# Altium project DASH_V_3.PrjPCB
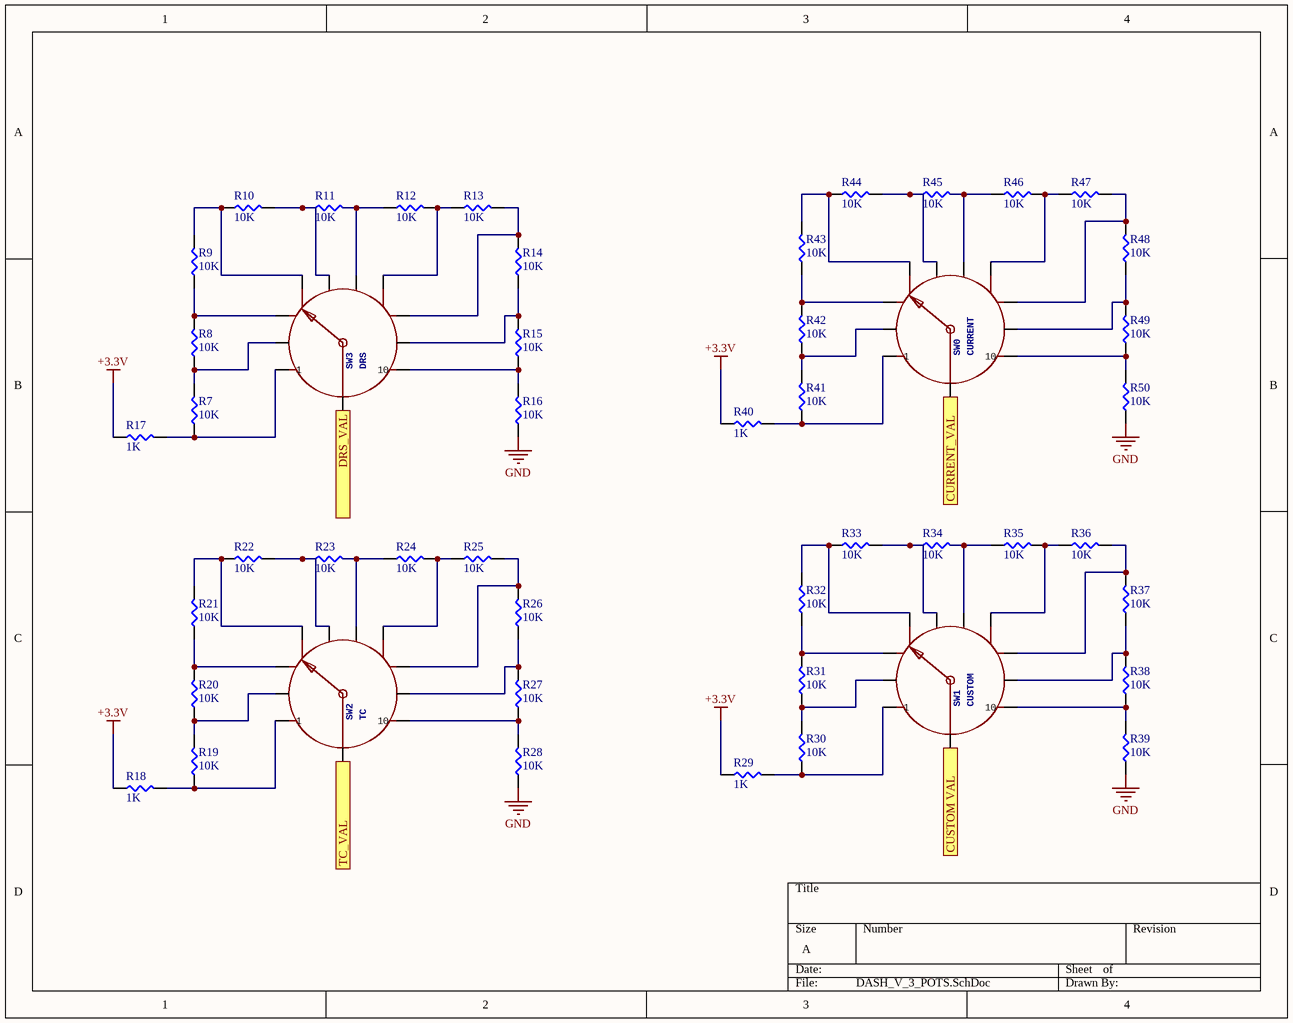
[diagram p0: DASH_V_3_POTS.SchDoc]
3 sheets, 94 parts. Net scope: flat (ports and power ports of the same name join across sheets).
Board file: DASH_V_3.PcbDoc
Sheets:
  DASH_V_3_POTS.SchDoc
  DASH_V_3_LEDS_POWER.SchDoc
  DASH_V_3_STM_CAN.SchDoc

## Sheet DASH_V_3_POTS.SchDoc
size A

### Parts
R7  10K  [RES-0603]
R8  10K  [RES-0603]
R9  10K  [RES-0603]
R10  10K  [RES-0603]
R11  10K  [RES-0603]
R12  10K  [RES-0603]
R13  10K  [RES-0603]
R14  10K  [RES-0603]
R15  10K  [RES-0603]
R16  10K  [RES-0603]
R17  1K  [RES-0603]
R18  1K  [RES-0603]
R19  10K  [RES-0603]
R20  10K  [RES-0603]
R21  10K  [RES-0603]
R22  10K  [RES-0603]
R23  10K  [RES-0603]
R24  10K  [RES-0603]
R25  10K  [RES-0603]
R26  10K  [RES-0603]
R27  10K  [RES-0603]
R28  10K  [RES-0603]
R29  1K  [RES-0603]
R30  10K  [RES-0603]
R31  10K  [RES-0603]
R32  10K  [RES-0603]
R33  10K  [RES-0603]
R34  10K  [RES-0603]
R35  10K  [RES-0603]
R36  10K  [RES-0603]
R37  10K  [RES-0603]
R38  10K  [RES-0603]
R39  10K  [RES-0603]
R40  1K  [RES-0603]
R41  10K  [RES-0603]
R42  10K  [RES-0603]
R43  10K  [RES-0603]
R44  10K  [RES-0603]
R45  10K  [RES-0603]
R46  10K  [RES-0603]
R47  10K  [RES-0603]
R48  10K  [RES-0603]
R49  10K  [RES-0603]
R50  10K  [RES-0603]
SW0  CURRENT  [SPARKFUN-ELECTROMECHANICAL_ROTARY_SWITCH_1X10_KIT]
SW1  CUSTOM  [SPARKFUN-ELECTROMECHANICAL_ROTARY_SWITCH_1X10_KIT]
SW2  TC  [SPARKFUN-ELECTROMECHANICAL_ROTARY_SWITCH_1X10_KIT]
SW3  DRS  [SPARKFUN-ELECTROMECHANICAL_ROTARY_SWITCH_1X10_KIT]

### Ports
CURRENT_VAL, CUSTOM VAL, DRS_VAL, TC_VAL

### Nets
+3.3V: R17.1 R18.1 R29.1 R40.1
GND: R16.1 R28.1 R39.1 R50.1
CURRENT_VAL: SW0.COMMON ; port CURRENT_VAL
CUSTOM VAL: SW1.COMMON ; port CUSTOM VAL
DRS_VAL: SW3.COMMON ; port DRS_VAL
TC_VAL: SW2.COMMON ; port TC_VAL
NetR7_1: R7.1 R17.2 SW3.1
NetR7_2: R7.2 R8.1 SW3.2
NetR8_2: R8.2 R9.1 SW3.3
NetR9_2: R9.2 R10.1 SW3.4
NetR10_2: R10.2 R11.1 SW3.5
NetR11_2: R11.2 R12.1 SW3.6
NetR12_2: R12.2 R13.1 SW3.7
NetR13_2: R13.2 R14.2 SW3.8
NetR14_1: R14.1 R15.2 SW3.9
NetR15_1: R15.1 R16.2 SW3.10
NetR18_2: R18.2 R19.1 SW2.1
NetR19_2: R19.2 R20.1 SW2.2
NetR20_2: R20.2 R21.1 SW2.3
NetR21_2: R21.2 R22.1 SW2.4
NetR22_2: R22.2 R23.1 SW2.5
NetR23_2: R23.2 R24.1 SW2.6
NetR24_2: R24.2 R25.1 SW2.7
NetR25_2: R25.2 R26.2 SW2.8
NetR26_1: R26.1 R27.2 SW2.9
NetR27_1: R27.1 R28.2 SW2.10
NetR29_2: R29.2 R30.1 SW1.1
NetR30_2: R30.2 R31.1 SW1.2
NetR31_2: R31.2 R32.1 SW1.3
NetR32_2: R32.2 R33.1 SW1.4
NetR33_2: R33.2 R34.1 SW1.5
NetR34_2: R34.2 R35.1 SW1.6
NetR35_2: R35.2 R36.1 SW1.7
NetR36_2: R36.2 R37.2 SW1.8
NetR37_1: R37.1 R38.2 SW1.9
NetR38_1: R38.1 R39.2 SW1.10
NetR40_2: R40.2 R41.1 SW0.1
NetR41_2: R41.2 R42.1 SW0.2
NetR42_2: R42.2 R43.1 SW0.3
NetR43_2: R43.2 R44.1 SW0.4
NetR44_2: R44.2 R45.1 SW0.5
NetR45_2: R45.2 R46.1 SW0.6
NetR46_2: R46.2 R47.1 SW0.7
NetR47_2: R47.2 R48.2 SW0.8
NetR48_1: R48.1 R49.2 SW0.9
NetR49_1: R49.1 R50.2 SW0.10

### Library data of the parts
R7-R50 = RES-0603
SW0-SW3 = SPARKFUN-ELECTROMECHANICAL_SWITCH_ROTARY_1X10KIT: GateName_1: G$1; SymbolName_1: SPARKFUN-ELECTROMECHANICAL_ROTARY-SWITCH-1X10; DeviceName: KIT; PROD_ID: SWCH-12120; LibraryName: Rotary_Switch_Potentiometer_v10; DeviceSetName: SPARKFUN-ELECTROMECHANICAL_SWITCH_ROTARY_1X10; Package: SPARKFUN-ELECTROMECHANICAL_ROTARY_SWITCH_1X10_KIT

## Sheet DASH_V_3_LEDS_POWER.SchDoc
size A
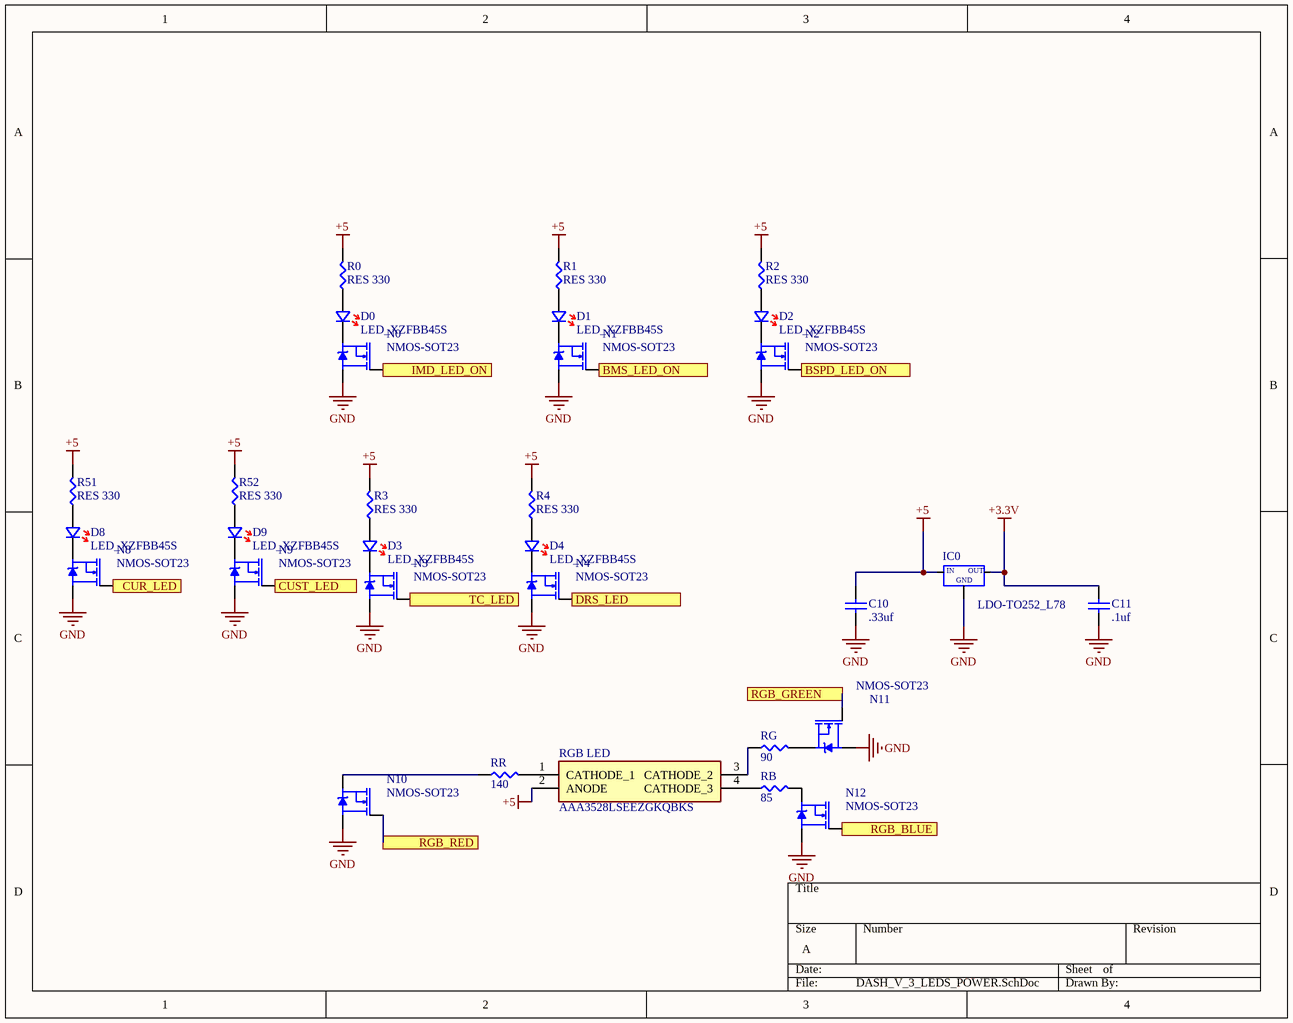
[diagram p1: DASH_V_3_LEDS_POWER.SchDoc]

### Parts
C10  .33uf  [CAPC1608X87X35NL15T15]
C11  .1uf  [CAPC1608X87X35NL15T15]
D0  LED_XZFBB45S  [LED_XZFBB45S]
D1  LED_XZFBB45S  [LED_XZFBB45S]
D2  LED_XZFBB45S  [LED_XZFBB45S]
D3  LED_XZFBB45S  [LED_XZFBB45S]
D4  LED_XZFBB45S  [LED_XZFBB45S]
D8  LED_XZFBB45S  [LED_XZFBB45S]
D9  LED_XZFBB45S  [LED_XZFBB45S]
IC0  LDO-TO252_L78  [TO252]
N0  NMOS-SOT23  [SOT23]
N1  NMOS-SOT23  [SOT23]
N2  NMOS-SOT23  [SOT23]
N3  NMOS-SOT23  [SOT23]
N4  NMOS-SOT23  [SOT23]
N8  NMOS-SOT23  [SOT23]
N9  NMOS-SOT23  [SOT23]
N10  NMOS-SOT23  [SOT23]
N11  NMOS-SOT23  [SOT23]
N12  NMOS-SOT23  [SOT23]
R0  RES 330  [RES-0603]
R1  RES 330  [RES-0603]
R2  RES 330  [RES-0603]
R3  RES 330  [RES-0603]
R4  RES 330  [RES-0603]
R51  RES 330  [RES-0603]
R52  RES 330  [RES-0603]
RB  85  [RES-0603]
RG  90  [RES-0603]
RGB_LED  AAA3528LSEEZGKQBKS  [AAA3528]
RR  140  [RES-0603]

### Ports
BMS_LED_ON, BSPD_LED_ON, CUR_LED, CUST_LED, DRS_LED, IMD_LED_ON, RGB_BLUE, RGB_GREEN, RGB_RED, TC_LED

### Nets
+3.3V: C11.2 IC0.3
+5: C10.2 IC0.1 R0.2 R1.2 R2.2 R3.2 R4.2 R51.2 R52.2 RGB_LED.2(ANODE)
GND: C10.1 C11.1 IC0.2 N0.2(S) N1.2(S) N2.2(S) N3.2(S) N4.2(S) N8.2(S) N9.2(S) N10.2(S) N11.2(S) N12.2(S)
BMS_LED_ON: N1.1(G) ; port BMS_LED_ON
BSPD_LED_ON: N2.1(G) ; port BSPD_LED_ON
CUR_LED: N8.1(G) ; port CUR_LED
CUST_LED: N9.1(G) ; port CUST_LED
DRS_LED: N4.1(G) ; port DRS_LED
IMD_LED_ON: N0.1(G) ; port IMD_LED_ON
RGB_BLUE: N12.1(G) ; port RGB_BLUE
RGB_GREEN: N11.1(G) ; port RGB_GREEN
RGB_RED: N10.1(G) ; port RGB_RED
TC_LED: N3.1(G) ; port TC_LED
NetD0_A: D0.A R0.1
NetD0_K: D0.K N0.3(D)
NetD1_A: D1.A R1.1
NetD1_K: D1.K N1.3(D)
NetD2_A: D2.A R2.1
NetD2_K: D2.K N2.3(D)
NetD3_A: D3.A R3.1
NetD3_K: D3.K N3.3(D)
NetD4_A: D4.A R4.1
NetD4_K: D4.K N4.3(D)
NetD8_A: D8.A R51.1
NetD8_K: D8.K N8.3(D)
NetD9_A: D9.A R52.1
NetD9_K: D9.K N9.3(D)
NetN10_3: N10.3(D) RR.1
NetN11_3: N11.3(D) RG.2
NetN12_3: N12.3(D) RB.2
NetRB_1: RB.1 RGB_LED.4(CATHODE_3)
NetRG_1: RG.1 RGB_LED.3(CATHODE_2)
NetRGB_LED_1: RGB_LED.1(CATHODE_1) RR.2

### Notes on the sheet
- (in symbol LDO-TO252_L78) IN; OUT; GND

### Library data of the parts
C10 C11 = CMP-2006-03887-1: .1 uf; Part Number: C0603C104J3RAC7867; Manufacturer: Kemet
R0-R4 R51 R52 RB RG RR = RES-0603
RGB_LED = AAA3528LSEEZGKQBKS: LED; Manufacturer_Name: Kingbright; Datasheet Link: https://componentsearchengine.com/Datasheets/1/AAA3528LSEEZGKQBKS.pdf; Mouser Part Number: 604-AAA3528LSEEZGKQB; Mouser Price/Stock: https://www.mouser.com/Search/Refine.aspx?Keyword=604-AAA3528LSEEZGKQB; Manufacturer_Part_Number: AAA3528LSEEZGKQBKS

## Sheet DASH_V_3_STM_CAN.SchDoc
size A
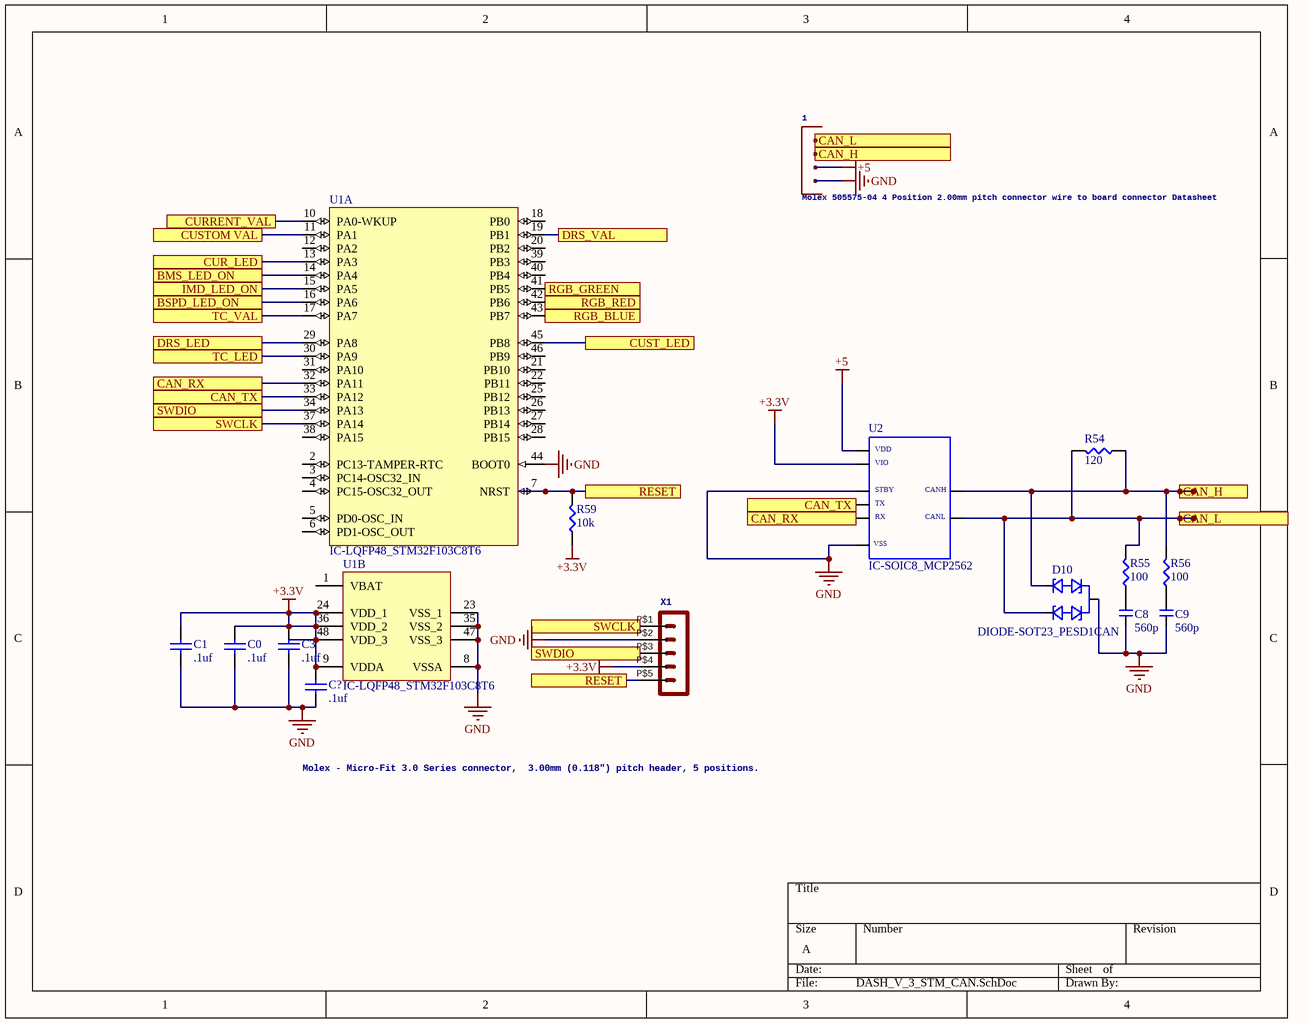
[diagram p2: DASH_V_3_STM_CAN.SchDoc]

### Parts
1  Molex 505575-04 4 Position 2.00mm pitch connector wire to board connector Datasheet  [505575-04]
C0  .1uf  [CAPC1608X87X35NL15T15]
C1  .1uf  [CAPC1608X87X35NL15T15]
C3  .1uf  [CAPC1608X87X35NL15T15]
C8  560p  [CAP-0603]
C9  560p  [CAP-0603]
C?  .1uf  [CAPC1608X87X35NL15T15]
D10  DIODE-SOT23_PESD1CAN  [SOT23]
R54  120  [RES-0603]
R55  100  [RES-0603]
R56  100  [RES-0603]
R59  10k  [RES-0603]
U1  IC-LQFP48_STM32F103C8T6  [STM-LQFP48_M]  (parts A,B of 2)
U2  IC-SOIC8_MCP2562  [SOIC8]
X1  Molex - Micro-Fit 3.0 Series connector,  3.00mm (0.118") pitch header, 5 positions.  [POS5_254MM_MALE]

### Ports
BMS_LED_ON, BSPD_LED_ON, CAN_H, CAN_L, CAN_RX, CAN_TX, CUR_LED, CURRENT_VAL, CUST_LED, CUSTOM VAL, DRS_LED, DRS_VAL, IMD_LED_ON, RESET, RGB_BLUE, RGB_GREEN, RGB_RED, SWCLK, SWDIO, TC_LED, TC_VAL

### Nets
+3.3V: C0.2 C1.2 C3.2 C?.2 R59.1 U1.9(VDDA) U1.24(VDD_1) U1.36(VDD_2) U1.48(VDD_3) U2.5 X1.P$4
+5: 1.3 U2.3
GND: 1.4 C0.1 C1.1 C3.1 C8.1 C9.1 C?.1 D10.3(G) U1.8(VSSA) U1.23(VSS_1) U1.35(VSS_2) U1.44(BOOT0) U1.47(VSS_3) U2.2 U2.8 X1.P$2
BMS_LED_ON: U1.14(PA4) ; port BMS_LED_ON
BSPD_LED_ON: U1.16(PA6) ; port BSPD_LED_ON
CAN_H: 1.2 D10.1(CAN1) R54.1 R56.2 U2.7 ; port CAN_H
CAN_L: 1.1 D10.2(CAN2) R54.2 R55.2 U2.6 ; port CAN_L
CAN_RX: U1.32(PA11) U2.4 ; port CAN_RX
CAN_TX: U1.33(PA12) U2.1 ; port CAN_TX
CUR_LED: U1.13(PA3) ; port CUR_LED
CURRENT_VAL: U1.10(PA0-WKUP) ; port CURRENT_VAL
CUST_LED: U1.45(PB8) ; port CUST_LED
CUSTOM VAL: U1.11(PA1) ; port CUSTOM VAL
DRS_LED: U1.29(PA8) ; port DRS_LED
DRS_VAL: U1.19(PB1) ; port DRS_VAL
IMD_LED_ON: U1.15(PA5) ; port IMD_LED_ON
RESET: R59.2 U1.7(NRST) X1.P$5 ; port RESET
RGB_BLUE: U1.43(PB7) ; port RGB_BLUE
RGB_GREEN: U1.41(PB5) ; port RGB_GREEN
RGB_RED: U1.42(PB6) ; port RGB_RED
SWCLK: U1.37(PA14) X1.P$1 ; port SWCLK
SWDIO: U1.34(PA13) X1.P$3 ; port SWDIO
TC_LED: U1.30(PA9) ; port TC_LED
TC_VAL: U1.17(PA7) ; port TC_VAL
NetC8_2: C8.2 R55.1
NetC9_2: C9.2 R56.1

Not connected (* = marked no-connect by the designer): U1 1(VBAT) 2(PC13-TAMPER-RTC) 3(PC14-OSC32_IN) 4(PC15-OSC32_OUT) 5(PD0-OSC_IN) 6(PD1-OSC_OUT) 12(PA2) 18(PB0) 20(PB2) 21(PB10) 22(PB11) 25(PB12) 26(PB13) 27(PB14) 28(PB15) 31(PA10) 38(PA15) 39(PB3) 40(PB4) 46(PB9)

### Notes on the sheet
- (in symbol IC-SOIC8_MCP2562) VDD; VIO; STBY; CANH; TX; RX; CANL; VSS

### Library data of the parts
1 = 505575-04: GateName_1: G$1; SymbolName_1: 4POS; LibraryName: MOLEX Micro-Lock; DeviceSetName: 505575-04; Package: 505575-04
C0 C1 C3 C? = CMP-2006-03887-1: as C10 on sheet DASH_V_3_LEDS_POWER
C8 C9 = CAP-0603
R54-R56 R59 = RES-0603
U1 = IC-LQFP48_STM32F103C8T6: A/D Converter: 2x12-bit (10 Channel); Core: ARM Cortex-M3; FLASH Size (Prog) (kB): 64; I/Os (High Current): 37; Internal RAM Size (kB): 20; Operating Frequency(F) (Processor speed) (MHz): 72; Packing: Tray; Supply Voltage(Vcc) min (V): 2; DatasheetVersion: Rev. 16; PackageVersion: Rev. 6, 06/2013; PackageReference: LQFP48; PackageDescription: 48-Pin Low Profile Quad Flat Package, 7 x 7 mm Body, 0.5 mm Pitch; Supplier 1: Digi-Key; Supplier Part Number 1: 497-6063-ND; Supplier 2: Farnell; Supplier Part Number 2: 1447637; Supplier 3: Newark; Supplier Part Number 3: 59M2182; Supplier 4: Newark; Supplier Part Number 4: 57P1222; Supplier 5: Mouser; Supplier Part Number 5: 511-STM32F103C8T6; Mounting Technology: Surface Mount; PartNumber: STM32F103C8T6; ComponentLink1Description: Manufacturer URL; ComponentLink1URL: http://www.st.com/web/en/home.html; ComponentLink2Description: Datasheet; ComponentLink2URL: http://www.st.com/st-web-ui/static/active/en/resource/technical/document/datasheet/CD00161566.pdf; ComponentLink3Description: Package Specification; ComponentLink3URL: http://www.st.com/st-web-ui/static/active/en/resource/technical/document/datasheet/DM00058181.pdf
X1 = POS5_254MM_MALE: GateName_1: G$1; SymbolName_1: HEADER_POS5; DeviceName: 43650-0524; DeviceSetName: HEADER_POS5_?; LibraryName: MOLEX Micro-Fit; Package: 43650-0524

## Nets that join several sheets
+3.3V: DASH_V_3_POTS (R17.1 R18.1 R29.1 R40.1), DASH_V_3_LEDS_POWER (C11.2 IC0.3), DASH_V_3_STM_CAN (11 pins)
+5: DASH_V_3_LEDS_POWER (10 pins), DASH_V_3_STM_CAN (1.3 U2.3)
GND: DASH_V_3_POTS (R16.1 R28.1 R39.1 R50.1), DASH_V_3_LEDS_POWER (13 pins), DASH_V_3_STM_CAN (16 pins)
BMS_LED_ON: DASH_V_3_LEDS_POWER (N1.1), DASH_V_3_STM_CAN (U1.14)
BSPD_LED_ON: DASH_V_3_LEDS_POWER (N2.1), DASH_V_3_STM_CAN (U1.16)
CUR_LED: DASH_V_3_LEDS_POWER (N8.1), DASH_V_3_STM_CAN (U1.13)
CURRENT_VAL: DASH_V_3_POTS (SW0.COMMON), DASH_V_3_STM_CAN (U1.10)
CUST_LED: DASH_V_3_LEDS_POWER (N9.1), DASH_V_3_STM_CAN (U1.45)
CUSTOM VAL: DASH_V_3_POTS (SW1.COMMON), DASH_V_3_STM_CAN (U1.11)
DRS_LED: DASH_V_3_LEDS_POWER (N4.1), DASH_V_3_STM_CAN (U1.29)
DRS_VAL: DASH_V_3_POTS (SW3.COMMON), DASH_V_3_STM_CAN (U1.19)
IMD_LED_ON: DASH_V_3_LEDS_POWER (N0.1), DASH_V_3_STM_CAN (U1.15)
RGB_BLUE: DASH_V_3_LEDS_POWER (N12.1), DASH_V_3_STM_CAN (U1.43)
RGB_GREEN: DASH_V_3_LEDS_POWER (N11.1), DASH_V_3_STM_CAN (U1.41)
RGB_RED: DASH_V_3_LEDS_POWER (N10.1), DASH_V_3_STM_CAN (U1.42)
TC_LED: DASH_V_3_LEDS_POWER (N3.1), DASH_V_3_STM_CAN (U1.30)
TC_VAL: DASH_V_3_POTS (SW2.COMMON), DASH_V_3_STM_CAN (U1.17)